# Altium schematic sheet power_board.SchDoc
size A3
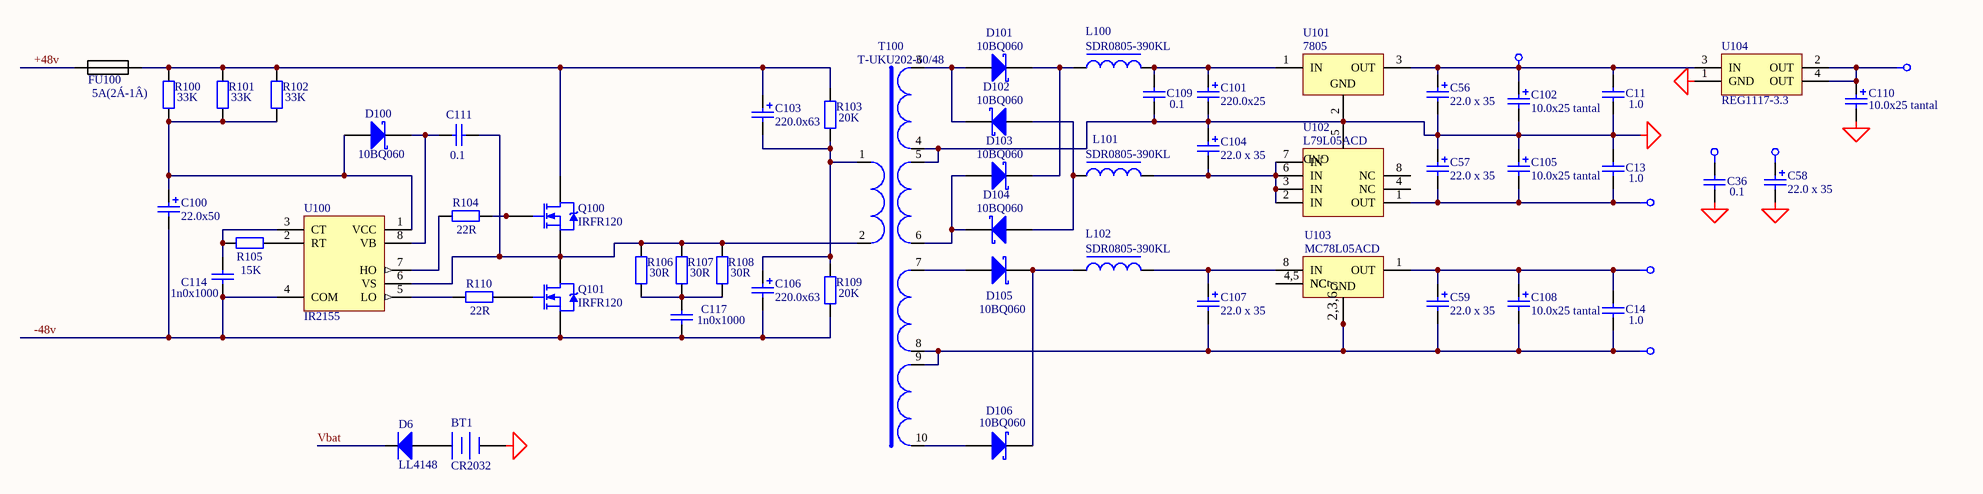
[diagram p0: power_board.SchDoc]

## Parts
BT1  CR2032  [BAT_SUPP]
C11  1.0  [C3216-1206]
C13  1.0  [C3216-1206]
C14  1.0  [C3216-1206]
C36  0.1  [C3216-1206]
C56  22.0 x 35  [el3]
C57  22.0 x 35  [el3]
C58  22.0 x 35  [el3]
C59  22.0 x 35  [el3]
C100  22.0x50  [el3]
C101  220.0x25  [el5]
C102  10.0x25 tantal  [CAP_EL_6_3]
C103  220.0x63  [el5]
C104  22.0 x 35  [el3]
C105  10.0x25 tantal  [CAP_EL_6_3]
C106  220.0x63  [el5]
C107  22.0 x 35  [el3]
C108  10.0x25 tantal  [CAP_EL_6_3]
C109  0.1  [C3216-1206]
C110  10.0x25 tantal  [CAP_EL_6_3]
C111  0.1  [C3216-1206]
C114  1n0x1000  [_1206]
C117  1n0x1000  [_1206]
D6  LL4148  [_1206d]
D100  10BQ060  [D_6_3]
D101  10BQ060  [D_6_3]
D102  10BQ060  [D_6_3]
D103  10BQ060  [D_6_3]
D104  10BQ060  [D_6_3]
D105  10BQ060  [D_6_3]
D106  10BQ060  [D_6_3]
FU100  5A(2Á-1Â)  [FUSE2]
L100  SDR0805-390KL  [L10x10]
L101  SDR0805-390KL  [L10x10]
L102  SDR0805-390KL  [L10x10]
Q100  IRFR120  [SIP-G3/E8]
Q101  IRFR120  [SIP-G3/E8]
R100  33K  [_1206]
R101  33K  [_1206]
R102  33K  [_1206]
R103  20K  [_1206]
R104  22R  [_1206]
R105  15K  [_1206]
R106  30R  [_1206]
R107  30R  [_1206]
R108  30R  [_1206]
R109  20K  [_1206]
R110  22R  [_1206]
T100  T-UKU202-60/48  [trans_ring1]
U100  IR2155  [DIP-8/D11]
U101  7805  [D2PAK]
U102  L79L05ACD  [SO-G8]
U103  MC78L05ACD  [SO-G8]
U104  REG1117-3.3  [SIP-G3/C7.4]

## Nets
+3v3: C36.2 C58.1 C110.1 U104.2(OUT) U104.4(OUT)
+5v: C11.2 C56.1 C102.1 U101.3(OUT) U104.3(IN)
+5viz: C14.2 C59.1 C108.1 U103.1(OUT)
-5v: C13.1 C57.2 C105.2 U102.1(OUT)
-5viz: C14.1 C59.2 C107.2 C108.2 T100.8(Vss) T100.9(Vss) U103.2(GND) U103.3(GND) U103.6(GND) U103.7(GND)
GND: BT1.2(-) C11.1 C13.2 C36.1 C56.2 C57.1 C58.2 C101.2 C102.2 C104.1 C105.1 C109.1 C110.2 T100.4(Vss) T100.5(Vss) U101.2(GND) U102.5(GND) U104.1(GND)
+48v: FU100.1
-48v: C100.2 C106.2 C114.2 C117.2 Q101.3(S) R109.2 U100.4(COM)
Vbat: D6.2(K)
NetBT1_1: BT1.1(+) D6.1(A)
NetC100_1: C100.1 D100.1(A) R100.2 R101.2 R102.2 U100.1(VCC)
NetC101_1: C101.1 C109.2 L100.2 U101.1(IN)
NetC103_1: C103.1 FU100.2 Q100.4(D) R100.1 R101.1 R102.1 R103.1
NetC103_2: C103.2 C106.1 R103.2 R109.1 T100.1(Vss)
NetC104_2: C104.2 L101.2 U102.2(IN) U102.3(IN) U102.6(IN) U102.7(IN)
NetC107_1: C107.1 L102.2 U103.8(IN)
NetC111_1: C111.1 D100.2(K) U100.8(VB)
NetC111_2: C111.2 Q100.3(S) Q101.4(D) R106.1 R107.1 R108.1 T100.2(Vss) U100.6(VS)
NetC114_1: C114.1 R105.1 U100.3(CT)
NetC117_1: C117.1 R106.2 R107.2 R108.2
NetD101_1: D101.1(A) D102.2(K) T100.3(Vss)
NetD101_2: D101.2(K) D103.2(K) L100.1
NetD102_1: D102.1(A) D104.1(A) L101.1
NetD103_1: D103.1(A) D104.2(K) T100.6(Vss)
NetD105_1: D105.1(A) T100.7(Vss)
NetD105_2: D105.2(K) D106.2(K) L102.1
NetD106_1: D106.1(A) T100.10(Vss)
NetQ100_1: Q100.1(G) R104.2
NetQ101_1: Q101.1(G) R110.2
NetR104_1: R104.1 U100.7(HO)
NetR105_2: R105.2 U100.2(RT)
NetR110_1: R110.1 U100.5(LO)
NetU103_4: U103.4(NC) U103.5(NC)

Not connected (* = marked no-connect by the designer): U102 4(NC) 8(NC)

## Notes on the sheet
- (in symbol MC78L05ACD) 4,5; 2,3,6,7

## Library data of the parts
BT1 = Battery: Multicell Battery; Manufacturer: Generic Components; Published: 24-Mar-1999; Revision: July-2002: Re-released for DXP Platform.; Publisher: Altium Limited
C11 C13 C14 C36 C109 C111 = Cap Semi: Capacitor (Semiconductor SIM Model); Manufacturer: Generic Components; Class I: Passive; Value: 0,1; Published: 8-Jun-2000; Revision: July-2002: Re-released for DXP Platform.; Publisher: Altium Limited; Class II: Capacitor
C56-C59 C102 C104 C105 C107 C108 C110 = Cap Pol1: Polarized Capacitor (Radial); Manufacturer: Generic Components; Class I: Passive; Value: 10,0x25; Published: 8-Jun-2000; Revision: July-2002: Re-released for DXP Platform.; Publisher: Altium Limited; Class II: Capacitor
C100 = Cap Pol1: Polarized Capacitor (Radial); Manufacturer: Generic Components; Class I: Passive; Value: 22,0x50; Published: 8-Jun-2000; Revision: July-2002: Re-released for DXP Platform.; Publisher: Altium Limited; Class II: Capacitor
C101 = Cap Pol1: Polarized Capacitor (Radial); Manufacturer: Generic Components; Class I: Passive; Value: 220,0x25; Published: 8-Jun-2000; Revision: July-2002: Re-released for DXP Platform.; Publisher: Altium Limited; Class II: Capacitor
C103 C106 = Cap Pol1: Polarized Capacitor (Radial); Manufacturer: Generic Components; Class I: Passive; Value: 220,0x63; Published: 8-Jun-2000; Revision: July-2002: Re-released for DXP Platform.; Publisher: Altium Limited; Class II: Capacitor
C114 C117 = Cap Semi: Capacitor (Semiconductor SIM Model); Manufacturer: Generic Components; Class I: Passive; Value: 1000; Published: 8-Jun-2000; Revision: July-2002: Re-released for DXP Platform.; Publisher: Altium Limited; Class II: Capacitor
D6 = Diode: Default Diode; Manufacturer: Generic Components; Class I: Discrete; Class II: Diode - Switching; Published: 8-Jun-2000; Revision: July-2002: Re-released for DXP Platform.; Publisher: Altium Limited
D100-D106 = 10BQ015: Schottky Rectifier; Manufacturer: International Rectifier; Revision 1: 10-July-2000: SIM Model Added.; Revision 2: July-2002: Re-released for DXP Platform.; Class I: Discrete; Class II: Rectifier - Schottky; Published: 8-Jun-2000; Datasheet: Latest Revision: PD-2.396A; Package Reference: DO-214AA; Publisher: Altium Limited
FU100 = FUSE
L100-L102 = Inductor Konstr 2: Magnetic-Core Inductor; Manufacturer: Generic Components; Class I: Passive; Published: 24-Mar-1999; Revision: July-2002: Re-released for DXP Platform.; Publisher: Altium Limited; Class II: Inductor
Q100 Q101 = IRFR120: HEXFET N-Channel Power MOSFET; Manufacturer: International Rectifier; Revision 1: 10-July-2000: SIM Model Added.; Revision 2: July-2002: Re-released for DXP Platform.; Class I: Discrete; Class II: MOSFET - Power; Note: Pin 2 is trimmed and is electrically connected to Drain.; Published: 8-Jun-2000; Datasheet: Latest Revision: PD-9.523D; Package Reference: TO-252AA; Publisher: Altium Limited
R100-R103 R105 R109 = Res2: Resistor; Manufacturer: Generic Components; Class I: Passive; Rule: Undefined; Published: 8-Jun-2000; Revision: July-2002: Re-released for DXP Platform.; Publisher: Altium Limited; Class II: Resistor
  R100-R102: Value: 33K
  R103 R109: Value: 20K
  R105: Value: 15K
R104 R110 = Res2: Resistor; Manufacturer: Generic Components; Class I: Passive; Value: 22; Rule: Undefined; Published: 8-Jun-2000; Revision: July-2002: Re-released for DXP Platform.; Publisher: Altium Limited; Class II: Resistor
R106-R108 = Res2: Resistor; Manufacturer: Generic Components; Class I: Passive; Value: 30; Rule: Undefined; Published: 8-Jun-2000; Revision: July-2002: Re-released for DXP Platform.; Publisher: Altium Limited; Class II: Resistor
T100 = TRANS_RING1
U100 = IR2155: Self-Oscillating Half-Bridge Driver; Manufacturer: International Rectifier; Class I: Interface; Published: 8-Jun-2000; Revision: July-2002: Re-released for DXP Platform.; Datasheet: Latest Revision: PD60029I; Package Reference: PDIP8; Publisher: Altium Limited; Class II: Bridge Driver
U101 = 7805: 3-Terminal Positive Fixed Voltage Regulator; Manufacturer: Motorola; Class I: Power Management; Note: Pin 2 is electrically connected to TAB; Published: 15-Apr-2002; Datasheet: Linear and Interface Integrated Circuits, DL128 Rev2 (1988); Package Reference: 221A-04; Publisher: Altium Limited; Class II: Voltage Regulator
U102 = L79L05ACD: Negative Voltage Regulator; Manufacturer: ST-Microelectronics; Package Information: Latest Revision: Jul-1998; Class I: Power Management; Published: 24-Aug-2001; Revision: July-2002: Re-released for DXP Platform.; Datasheet: Latest Revision: Apr-1999; Package Reference: SO8; Publisher: Altium Limited; Class II: Voltage Regulator
U103 = MC78L05ACD: 3-Terminal Low-Current Positive Fixed Voltage Regulator; Manufacturer: Motorola; Class I: Power Management; Published: 15-Apr-2002; Datasheet: Linear and Interface Integrated Circuits, DL128 Rev2 (1988); Package Reference: 751-02; Publisher: Altium Limited; Class II: Voltage Regulator
U104 = REG1117-3.3: 800mA and 1A Low Dropout Positive Regulator 2.85V, 3.3V, 5V, and Adjustable; Manufacturer: Burr-Brown; Package Information: Latest Revision: Rev. C; Class I: Power Management; Class II: Voltage Regulator; Published: 8-Jun-2000; Revision: July-2002: Re-released for DXP Platform.; Datasheet: Latest Revision: Sep-1997; Package Reference: ZZ311; Publisher: Altium Limited